# EAGLE design sharpmem_bob (EAGLE 8.6.0)
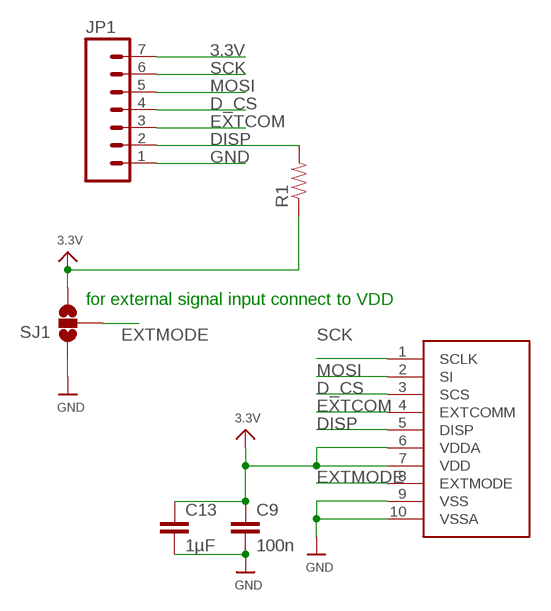
[diagram p0: schematic, sheet 1]

## Parts
C9  100n  C-EUC0402  [C0402]
C13  1µF  C-EUC0402  [C0402]
JP1  M07  [1X07]
R1  RESISTOR0402-RES  [0402-RES]
SJ1  SOLDERJUMPER_2WAYS  [SJ_3]
U$2  SHARP_MEM_DISP  [Y5BW]

## Nets
3.3V [power]: C9.1 C13.1 JP1.7 R1.1 SJ1.3 U$2.6(VDDA) U$2.7(VDD)
D_CS: JP1.4 U$2.3(SCS)
DISP: JP1.2 R1.2 U$2.5(DISP)
EXTCOM: JP1.3 U$2.4(EXTCOMM)
EXTMODE [power]: SJ1.2 U$2.8(EXTMODE)
GND: C9.2 C13.2 JP1.1 SJ1.1 U$2.9(VSS) U$2.10(VSSA)
MOSI: JP1.5 U$2.2(SI)
SCK: JP1.6 U$2.1(SCLK)

## Notes on the sheet
- for external signal input connect to VDD

## Library data of the parts
C9 C13 = rcl:C-EU: CAPACITOR, European symbol
JP1 = SparkFun-Connectors:M07: Header 7 Standard 7-pin 0.1" header. Use with straight break away headers (SKU : PRT-00116), right angle break away headers (PRT-00553), swiss pins (PRT-00743), machine pins (PRT-00117), and female headers (PRT-00115). NOTES ON THE VARIANTS LOCK and LOCK_LONGPADS... This footprint was designed to help hold the alignment of a through-hole component (i.e. 7-pin header) while soldering it into place. You may notice that each hole has been shifted either up or down by 0.005 of an inch from it's more standard position (which is usually a perfectly straight line). This slight alteration caused the pins (the squares in the middle) to touch the edges of the holes. Because they are alternating, it causes a "brace" to hold the header in place. 0.005 has proven to be the perfect amount of "off-center" position when using our standard breakaway headers. Although looks a little odd when you look at the bare footprint, once you have a header in there, the alteration is very hard to notice. Also, if you push a header all the way into place, it is covered up entirely on the bottom side. This idea of altering the position of holes to aid alignment will be further integrated into the Sparkfun Library for other footprints. It can help hold any component with 3 or more connection pins.
R1 = SparkFun-Passives:RESISTOR: Resistor Basic schematic elements and footprints for 0603, 1206, and PTH resistors.
SJ1 = SparkFun-Retired:SOLDERJUMPER_2WAY: Solder Jumper 2 way solder jumper
U$2 = AYF531035:SHARP_MEM_DISP

## Net classes
1 power: width 0.254 mm

## Board
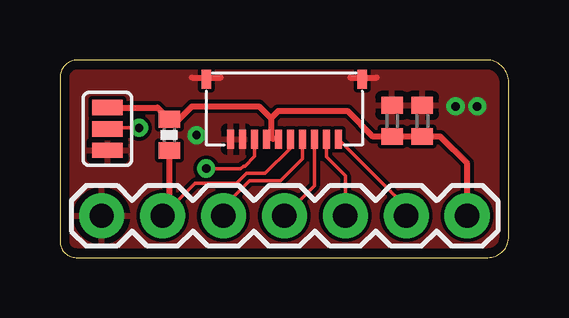
[diagram p1: board, top side]
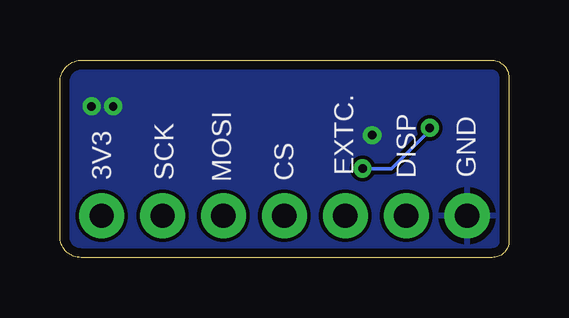
[diagram p2: board, bottom side, seen from below]

Size 18.72 x 8.23 mm. Coordinates in mm from the lower left corner, seen from the top.
Outline: 0.68,0 17.84,0 arc90 18.72,0.88 18.72,7.3 arc90 17.79,8.23 0.73,8.23 arc90 0,7.5 0,0.68 arc90 0.68,0
Copper layers (1*16): Top 0.035mm / dielectric 1.5mm / Bottom 0.035mm
Design rules "default *": minimum track width 6mil, minimum drill 0.35mm, track to track 6mil, track to pad 6mil, pad to pad 6mil, via to via 6mil, smd to smd 6mil, copper to edge 15mil, drill to drill 6mil, minimum pad ring 10mil, minimum via ring 8mil, stop-mask expansion 4mil, vias tented up to drill 20mil, thermal gap 10mil

### Footprints (pad centres in the part's own frame; a part is rotated, then mirrored left to right if it is on the bottom)
C0402 = smd 0.7 x 0.9: 1 -0.65,0; 2 0.65,0
1X07 = drill 1.016 pad 1.88: 1 0,0; 2 2.54,0; 3 5.08,0; 4 7.62,0; 5 10.16,0; 6 12.7,0; 7 15.24,0
0402-RES = smd 0.7 x 0.9: 1 -0.65,0; 2 0.65,0
SJ_3 = smd 0.635 x 1.27: 1 -0.889,0; 2 0,0; 3 0.889,0
Y5BW = smd 0.3 x 0.8: 1 -2.25,0; 2 -1.75,0; 3 -1.25,0; 4 -0.75,0; 5 -0.25,0; 6 0.25,0; 7 0.75,0; 8 1.25,0; 9 1.75,0; 10 2.25,0 | smd 0.4 x 0.8: P$11 -3.25,-2.5; P$12 3.25,-2.5

### Placement (x,y rotation side)
C9  15.11,5.69 90 top
C13  13.85,5.69 90 top
JP1  1.74,1.74 0 top
R1  4.56,5.11 270 top
SJ1  1.98,5.36 90 top
U$2  9.36,4.93 180 top

### Tracks (layer width: path | path; a pad name or v marks a point on that pad's centre or on a via)
3.3V
  Top 0.152: U$2.7 8.9,4.93 U$2.6
  Top 0.254: SJ1.3 4.07,6.25 R1.1 4.96,5.76 5.5,6.3 8.3,6.3 8.8,5.8 | 8.8,5.8 8.8,5.03 8.9,4.93 | JP1.7 16.98,3.92 15.86,5.04 C9.1 C13.1 13.06,5.04 12,6.1 9.1,6.1 8.8,5.8
D_CS
  Top 0.152: U$2.3 10.61,2.99 JP1.4
DISP
  Top 0.152: JP1.2 4.47,1.93 5.64,3.1 7.37,3.1 7.77,3.5 8.56,3.5 9.61,4.56 U$2.5
  Top 0.254: R1.2 4.56,2.02 4.47,1.93
EXTCOM
  Top 0.152: U$2.4 10.11,4.11 9.2,3.2 7.9,3.2 6.82,2.12 JP1.3
EXTMODE  (via drill 0.35)
  Top 0.152: U$2.8 8.11,4.21 7.71,3.81 7.65,3.81 7.54,3.7 v6.1,3.7 v6.1,3.71 | v3.3,5.4 2.02,5.4 SJ1.2
  Bottom 0.152: v6.1,3.71 4.89,3.71 3.3,5.3 v3.3,5.4
GND  (via drill 0.35)
  Top 0.254: 5.5,7.5 6.7,7.5 | 12.1,7.5 13.2,7.5
  other vias: 5.7,5.1 16.5,6.3 17.4,6.3
  pour Bottom: -1.2,11.9 -1.2,-1 19.8,-1 19.8,12.1 -1.2,12.1 -1.2,12
  pour Top: -0.5,11.5 -0.5,-0.5 19.3,-0.5 19.3,11.5
MOSI
  Top 0.152: U$2.2 11.11,4.19 11.9,3.4 JP1.5
SCK
  Top 0.152: U$2.1 14.44,2.1 JP1.6

### Text on the board
bPlace: EXTC. | GND | DISP | MOSI | SCK | CS | 3V3